# Altium project Fuel Cell Monitor Master.PrjPcb
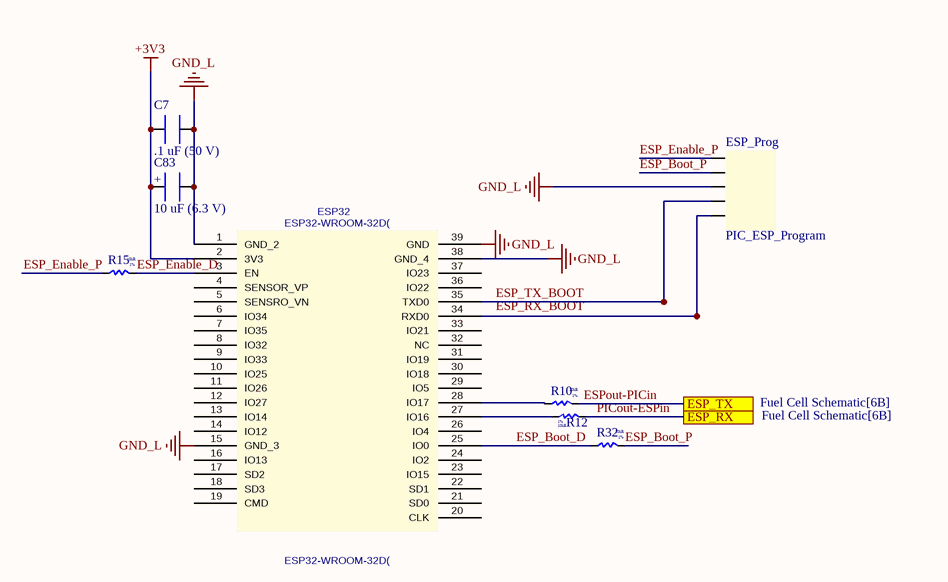
[diagram p0: ESP32.SchDoc]
1 sheet, 8 parts. Net scope: flat (ports and power ports of the same name join across sheets).
Board file: FCM_Integrated.PcbDoc

## Sheet ESP32.SchDoc
size A; SheetNumber: 12; SheetTotal: 13

### Parts
C7  .1 uF (50 V)  [.1uF capacitor]
C83  10 uF (6.3 V)  [10 uF cap]
ESP32  ESP32-WROOM-32D(  [ESP32]
ESP_Prog  PIC_ESP_Program  [ESP_Program]
R10  Tolerance: 1%  Resistance: 10kR  [Resistor_YAGEO_0805]
R12  Tolerance: 1%  Resistance: 10kR  [Resistor_YAGEO_0805]
R15  Tolerance: 1%  Resistance: 10kR  [Resistor_YAGEO_0805]
R32  Tolerance: 1%  Resistance: 10kR  [Resistor_YAGEO_0805]

### Ports
ESP_RX (see Fuel Cell Schematic[6B]), ESP_TX (see Fuel Cell Schematic[6B])

### Nets
+3V3: C7.1 C83.1 ESP32.2(3V3)
GND_L: C7.2 C83.2 ESP32.1(GND_2) ESP32.15(GND_3) ESP32.38(GND_4) ESP32.39(GND) ESP_Prog.3(GND)
ESP_Boot_D: ESP32.25(IO0) R32.1
ESP_Boot_P: ESP_Prog.4(Boot) R32.2
ESP_Enable_D: ESP32.3(EN) R15.2
ESP_Enable_P: ESP_Prog.5(Enable) R15.1
ESP_TX_BOOT: ESP32.35(TXD0) ESP_Prog.2(RX)
ESPout-PICin: R10.2 ; port ESP_TX
PICout-ESPin: R12.2 ; port ESP_RX
NetESP32_27: ESP32.27(IO16) R12.1
NetESP32_28: ESP32.28(IO17) R10.1
NetESP32_34: ESP32.34(RXD0) ESP_Prog.1(TX)

Not connected (* = marked no-connect by the designer): ESP32 4(SENSOR_VP) 5(SENSRO_VN) 6(IO34) 7(IO35) 8(IO32) 9(IO33) 10(IO25) 11(IO26) 12(IO27) 13(IO14) 14(IO12) 16(IO13) 17(SD2) 18(SD3) 19(CMD) 20(CLK) 21(SD0) 22(SD1) 23(IO15) 24(IO2) 26(IO4) 29(IO5) 30(IO18) 31(IO19) 32(NC) 33(IO21) 36(IO22) 37(IO23)

### Notes on the sheet
- Labels drawn without touching a wire or pin: ESP_RX_BOOT
- (in symbol 10 uF cap) +

### Library data of the parts
C7 = .1 uF cap
C83 = 10 uF cap
ESP32 = ESP32-WROOM-32D(: Mfr_Name: Espressif Systems; Manufacturer_Part_Number: ESP32-WROOM-32D(M113DH6400PH3Q0); C: Copyright (C) 2018 Accelerated Designs. All rights reserved; Copyright: Copyright (C) 2023 Ultra Librarian. All rights reserved.; Value: ESP32-WROOM-32D(
R10 R12 R15 R32 = RC0805FR-1010KL: RES 10K OHM 1% 1/8W 0805; Manufacturer: Yageo; Power Rating: 125mW; Voltage Rating: 150V; Temperature Coefficient: 100ppm/°C; Supplier 1: Digi-Key; Manufacturer Part Number: RC0805FR-1010KL; RoHS: Yes; Category: Chip SMD Resistors; Stock 1: 112355; Pricing 1: 1=0.10000, 10=0.03700, 100=0.01510, 1000=0.00680, 2500=0.00590, 5000=0.00487 (USD); Case/Package: 0805; Number of Pins: 2; Case Code (Imperial): 0805; Case Code (Metric): 2012; Contact Plating: Tin,Lead,Matte; Min Operating Temperature: -55°C; Max Operating Temperature: 155°C; Packaging: Tape and Reel; Resistor Type: Thick Film; Termination: SMD/SMT; Voltage Rating (DC): 150V; Series: RC; Resistance Tolerance: 1%; Construction: Rectangular; Length: 2mm; Width: 1.25mm; Height: 0.5mm; Depth: 1.25mm; Radiation Hardening: No; REACH SVHC: No SVHC; Military Standard: Not; RoHS Compliant: Yes; ComponentLink1URL: https://datasheet.ciiva.com/7983/444164-7983754.pdf?src-supplier=Element14; ComponentLink1Description: https://datasheet.ciiva.com/7983/444164-7983754.pdf?src-supplier=Element14; ComponentLink2URL: https://datasheet.ciiva.com/15190/getdatasheetpartid-496654-15190027.pdf?src-supplier=Verical; ComponentLink2Description: https://datasheet.ciiva.com/15190/getdatasheetpartid-496654-15190027.pdf?src-supplier=Verical; Supplier Part Number 1: 13-RC0805FR-1010KLCT-ND